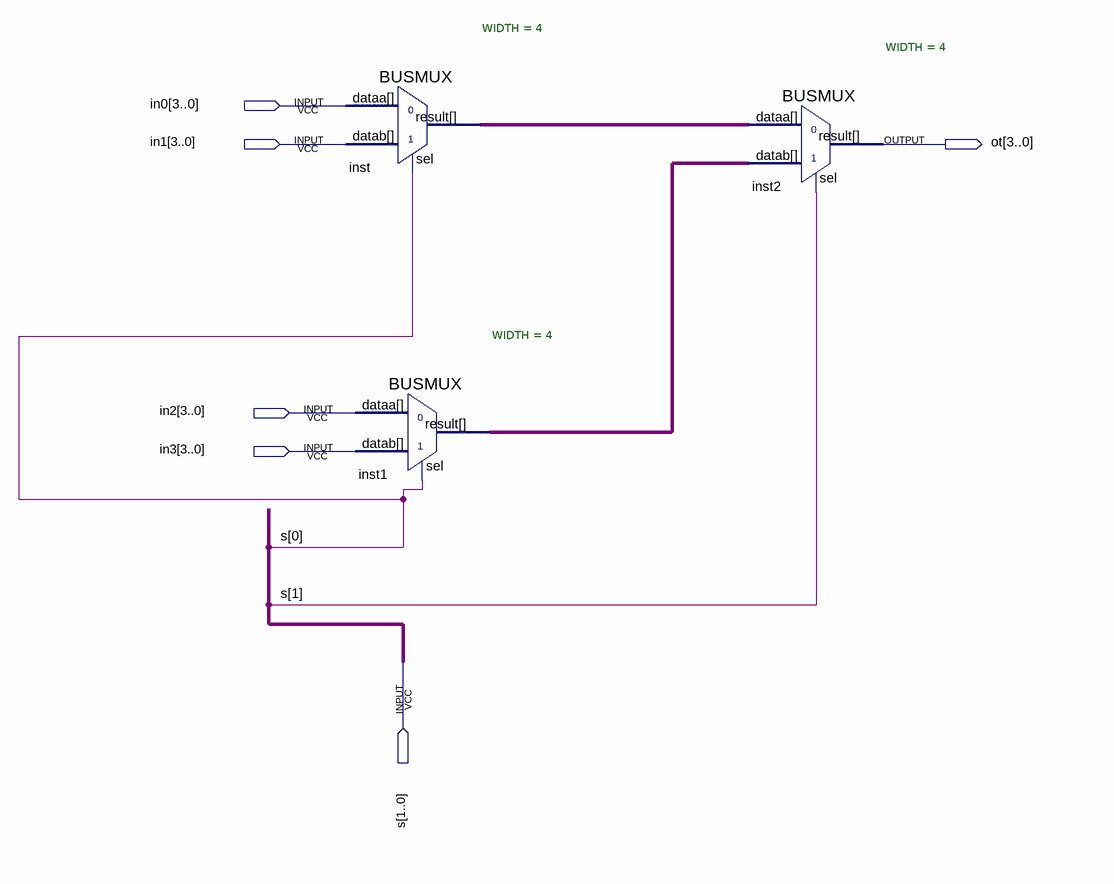
[diagram p0: schematic sheet]
// Quartus schematic Ass1.bdf as structural Verilog: 3 symbols, 6 pins
module Ass1 (
  input  [3:0] in0,
  input  [3:0] in1,
  input  [3:0] in2,
  input  [3:0] in3,
  input  [1:0] s,
  output [3:0] ot
);

  wire [3:0] inst1_result, inst_result;

  BUSMUX #(.WIDTH(4)) inst (.datab(in1), .sel(s[0]), .dataa(in0), .result(inst_result));
  BUSMUX #(.WIDTH(4)) inst1 (.datab(in3), .sel(s[0]), .dataa(in2), .result(inst1_result));
  BUSMUX #(.WIDTH(4)) inst2 (.datab(inst1_result), .sel(s[1]), .dataa(inst_result), .result(ot));
endmodule
